# Altium schematic sheet mcu_base.SchDoc
size Letter
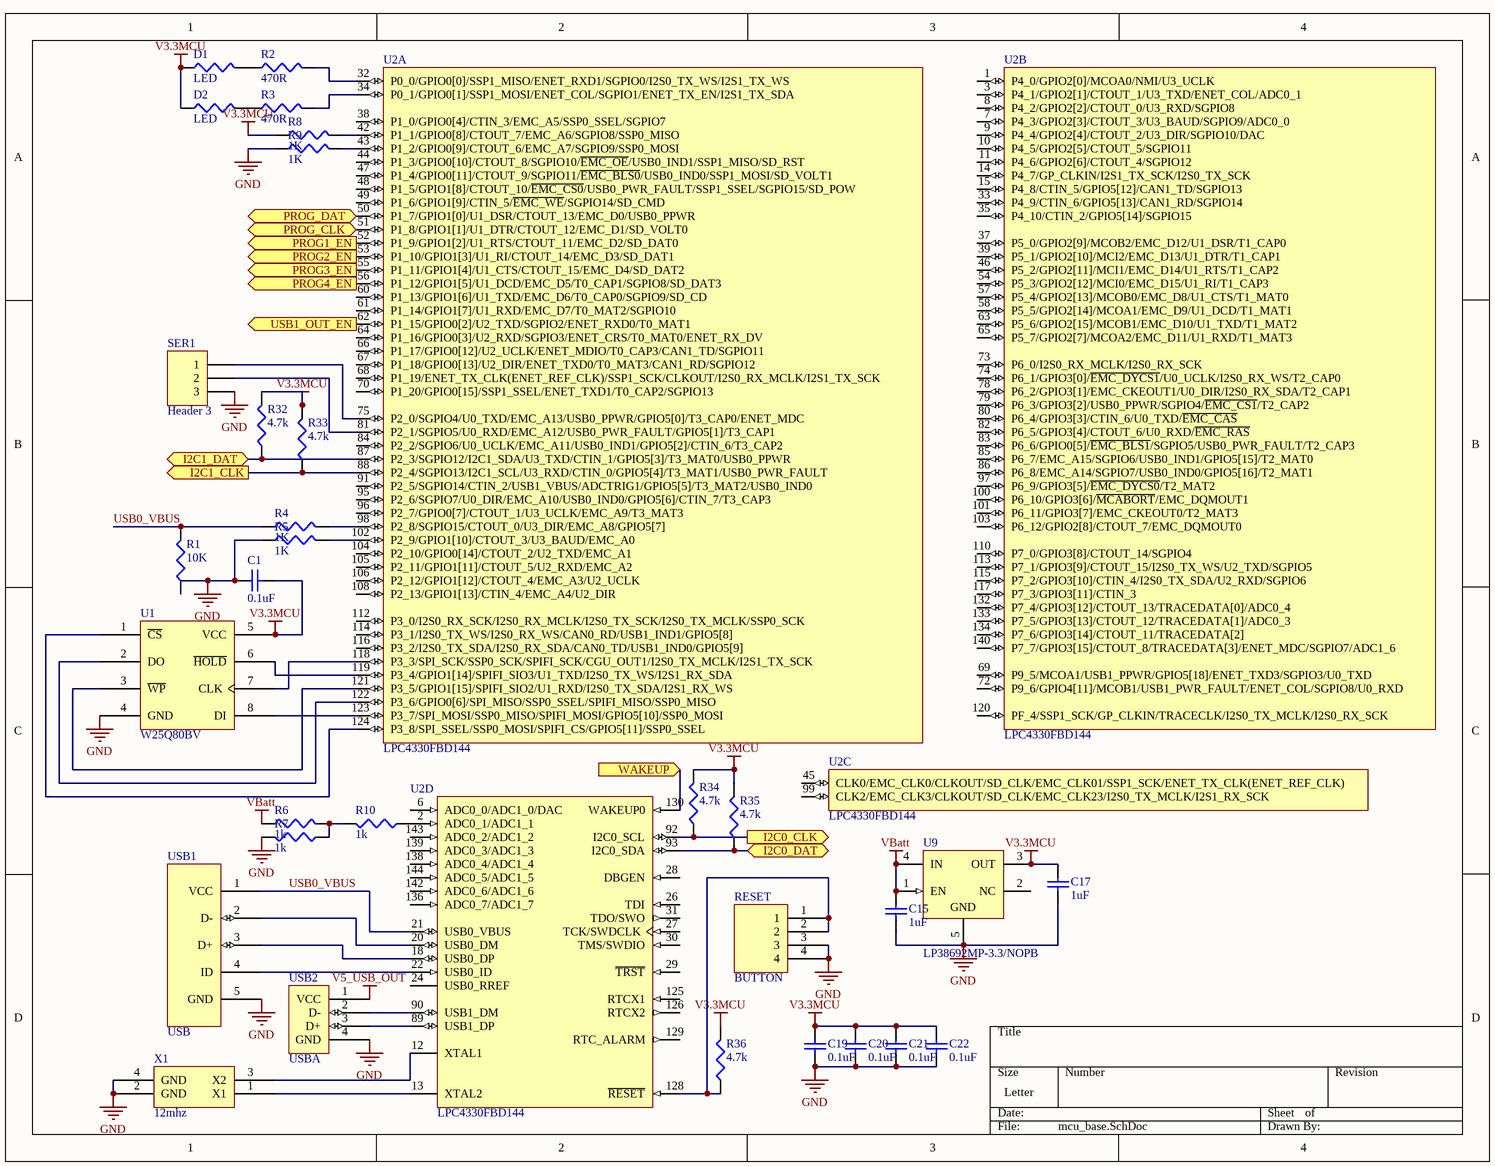
[diagram p0: mcu_base.SchDoc]

## Parts
C1  0.1uF  [1608[0603]]
C15  1uF  [1608[0603]]
C17  1uF  [1608[0603]]
C19  0.1uF  [1608[0603]]
C20  0.1uF  [1608[0603]]
C21  0.1uF  [1608[0603]]
C22  0.1uF  [1608[0603]]
D1  LED  [J1-0603]
D2  LED  [J1-0603]
R1  10K  [J1-0603]
R2  470R  [J1-0603]
R3  470R  [J1-0603]
R4  1K  [J1-0603]
R5  1K  [J1-0603]
R6  1k  [J1-0603]
R7  1k  [J1-0603]
R8  1K  [J1-0603]
R9  1K  [J1-0603]
R10  1k  [J1-0603]
R32  4.7k  [J1-0603]
R33  4.7k  [J1-0603]
R34  4.7k  [J1-0603]
R35  4.7k  [J1-0603]
R36  4.7k  [J1-0603]
RESET  BUTTON  [B3FS_SWITCH]
SER1  Header 3  [HDR1X3]
U1  W25Q80BV  [D8_N]
U2  LPC4330FBD144  [SOT486-1_V]  (parts A,B,C,D of 5)
U9  LP38692MP-3.3/NOPB  [MP05A_N]
USB1  USB  [USB/SM0.8-6H5]
USB2  USBA  [USB2.5-2V4A]
X1  12mhz  [2SMX-3SMXB]

## Ports
I2C0_CLK (out), I2C0_DAT (bidir), I2C1_CLK (out), I2C1_DAT (bidir), PROG1_EN (out), PROG2_EN (out), PROG3_EN (out), PROG4_EN (out), PROG_CLK (bidir), PROG_DAT (bidir), USB1_OUT_EN (out), WAKEUP (in)

## Nets
GND: C1.1 C15.1 C17.1 C19.1 C20.1 C21.1 C22.1 R1.1 R5.1 R7.2 R9.1 RESET.3 RESET.4 SER1.3 U1.4(GND) U9.5(GND) USB1.5(GND) USB2.4(GND) X1.2(GND) X1.4(GND)
V3.3MCU: C1.2 C17.2 C19.2 C20.2 C21.2 C22.2 D1.1 D2.1 R8.1 R32.2 R33.2 R34.2 R35.2 R36.2 U1.5(VCC) U9.3(OUT)
V5_USB_OUT: USB2.1(VCC)
VBatt: C15.2 R6.1 U9.1(EN) U9.4(IN)
I2C0_CLK: R34.1 U2.92(I2C0_SCL) ; port I2C0_CLK
I2C0_DAT: R35.1 U2.93(I2C0_SDA) ; port I2C0_DAT
I2C1_CLK: R33.1 U2.88(P2_4/SGPIO13/I2C1_SCL/U3_RXD/CTIN_0/GPIO5[4]/T3_MAT1/USB0_PWR_FAULT) ; port I2C1_CLK
I2C1_DAT: R32.1 U2.87(P2_3/SGPIO12/I2C1_SDA/U3_TXD/CTIN_1/GPIO5[3]/T3_MAT0/USB0_PPWR) ; port I2C1_DAT
PROG1_EN: U2.52(P1_9/GPIO1[2]/U1_RTS/CTOUT_11/EMC_D2/SD_DAT0) ; port PROG1_EN
PROG2_EN: U2.53(P1_10/GPIO1[3]/U1_RI/CTOUT_14/EMC_D3/SD_DAT1) ; port PROG2_EN
PROG3_EN: U2.55(P1_11/GPIO1[4]/U1_CTS/CTOUT_15/EMC_D4/SD_DAT2) ; port PROG3_EN
PROG4_EN: U2.56(P1_12/GPIO1[5]/U1_DCD/EMC_D5/T0_CAP1/SGPIO8/SD_DAT3) ; port PROG4_EN
PROG_CLK: U2.51(P1_8/GPIO1[1]/U1_DTR/CTOUT_12/EMC_D1/SD_VOLT0) ; port PROG_CLK
PROG_DAT: U2.50(P1_7/GPIO1[0]/U1_DSR/CTOUT_13/EMC_D0/USB0_PPWR) ; port PROG_DAT
USB0_VBUS: R1.2 R4.1 U2.21(USB0_VBUS) USB1.1(VCC)
USB1_OUT_EN: U2.62(P1_15/GPIO0[2]/U2_TXD/SGPIO2/ENET_RXD0/T0_MAT1) ; port USB1_OUT_EN
WAKEUP: U2.130(WAKEUP0) ; port WAKEUP
NetD1_2: D1.2 R2.1
NetD2_2: D2.2 R3.1
NetR2_2: R2.2 U2.32(P0_0/GPIO0[0]/SSP1_MISO/ENET_RXD1/SGPIO0/I2S0_TX_WS/I2S1_TX_WS)
NetR3_2: R3.2 U2.34(P0_1/GPIO0[1]/SSP1_MOSI/ENET_COL/SGPIO1/ENET_TX_EN/I2S1_TX_SDA)
NetR4_2: R4.2 U2.98(P2_8/SGPIO15/CTOUT_0/U3_DIR/EMC_A8/GPIO5[7])
NetR5_2: R5.2 U2.102(P2_9/GPIO1[10]/CTOUT_3/U3_BAUD/EMC_A0)
NetR6_2: R6.2 R7.1 R10.2
NetR8_2: R8.2 U2.42(P1_1/GPIO0[8]/CTOUT_7/EMC_A6/SGPIO8/SSP0_MISO)
NetR9_2: R9.2 U2.43(P1_2/GPIO0[9]/CTOUT_6/EMC_A7/SGPIO9/SSP0_MOSI)
NetR10_1: R10.1 U2.2(ADC0_1/ADC1_1)
NetR36_1: R36.1 RESET.1 RESET.2 U2.128(~{RESET})
NetSER1_1: SER1.1 U2.75(P2_0/SGPIO4/U0_TXD/EMC_A13/USB0_PPWR/GPIO5[0]/T3_CAP0/ENET_MDC)
NetSER1_2: SER1.2 U2.81(P2_1/SGPIO5/U0_RXD/EMC_A12/USB0_PWR_FAULT/GPIO5[1]/T3_CAP1)
NetU1_1: U1.1(~{CS}) U2.124(P3_8/SPI_SSEL/SSP0_MOSI/SPIFI_CS/GPIO5[11]/SSP0_SSEL)
NetU1_2: U1.2(DO) U2.122(P3_6/GPIO0[6]/SPI_MISO/SSP0_SSEL/SPIFI_MISO/SSP0_MISO)
NetU1_3: U1.3(~{WP}) U2.121(P3_5/GPIO1[15]/SPIFI_SIO2/U1_RXD/I2S0_TX_SDA/I2S1_RX_WS)
NetU1_6: U1.6(~{HOLD}) U2.119(P3_4/GPIO1[14]/SPIFI_SIO3/U1_TXD/I2S0_TX_WS/I2S1_RX_SDA)
NetU1_7: U1.7(CLK) U2.118(P3_3/SPI_SCK/SSP0_SCK/SPIFI_SCK/CGU_OUT1/I2S0_TX_MCLK/I2S1_TX_SCK)
NetU1_8: U1.8(DI) U2.123(P3_7/SPI_MOSI/SSP0_MISO/SPIFI_MOSI/GPIO5[10]/SSP0_MOSI)
NetU2_12: U2.12(XTAL1) X1.3(X2)
NetU2_13: U2.13(XTAL2) X1.1(X1)
NetU2_18: U2.18(USB0_DP) USB1.3(D+)
NetU2_20: U2.20(USB0_DM) USB1.2(D-)
NetU2_22: U2.22(USB0_ID) USB1.4(ID)
NetU2_89: U2.89(USB1_DP) USB2.3(D+)
NetU2_90: U2.90(USB1_DM) USB2.2(D-)

Not connected (* = marked no-connect by the designer): U2 1(P4_0/GPIO2[0]/MCOA0/NMI/U3_UCLK) 3(P4_1/GPIO2[1]/CTOUT_1/U3_TXD/ENET_COL/ADC0_1) 6(ADC0_0/ADC1_0/DAC) 7(P4_3/GPIO2[3]/CTOUT_3/U3_BAUD/SGPIO9/ADC0_0) 8(P4_2/GPIO2[2]/CTOUT_0/U3_RXD/SGPIO8) 9(P4_4/GPIO2[4]/CTOUT_2/U3_DIR/SGPIO10/DAC) 10(P4_5/GPIO2[5]/CTOUT_5/SGPIO11) 11(P4_6/GPIO2[6]/CTOUT_4/SGPIO12) 14(P4_7/GP_CLKIN/I2S1_TX_SCK/I2S0_TX_SCK) 15(P4_8/CTIN_5/GPIO5[12]/CAN1_TD/SGPIO13) 24(USB0_RREF) 26(TDI) 27(TCK/SWDCLK) 28(DBGEN) 29(~{TRST}) 30(TMS/SWDIO) 31(TDO/SWO) 33(P4_9/CTIN_6/GPIO5[13]/CAN1_RD/SGPIO14) 35(P4_10/CTIN_2/GPIO5[14]/SGPIO15) 37(P5_0/GPIO2[9]/MCOB2/EMC_D12/U1_DSR/T1_CAP0) 38(P1_0/GPIO0[4]/CTIN_3/EMC_A5/SSP0_SSEL/SGPIO7) 39(P5_1/GPIO2[10]/MCI2/EMC_D13/U1_DTR/T1_CAP1) 44(P1_3/GPIO0[10]/CTOUT_8/SGPIO10/~{EMC_OE}/USB0_IND1/SSP1_MISO/SD_RST) 45(CLK0/EMC_CLK0/CLKOUT/SD_CLK/EMC_CLK01/SSP1_SCK/ENET_TX_CLK(ENET_REF_CLK)) 46(P5_2/GPIO2[11]/MCI1/EMC_D14/U1_RTS/T1_CAP2) 47(P1_4/GPIO0[11]/CTOUT_9/SGPIO11/~{EMC_BLS0}/USB0_IND0/SSP1_MOSI/SD_VOLT1) 48(P1_5/GPIO1[8]/CTOUT_10/~{EMC_CS0}/USB0_PWR_FAULT/SSP1_SSEL/SGPIO15/SD_POW) 49(P1_6/GPIO1[9]/CTIN_5/~{EMC_WE}/SGPIO14/SD_CMD) 54(P5_3/GPIO2[12]/MCI0/EMC_D15/U1_RI/T1_CAP3) 57(P5_4/GPIO2[13]/MCOB0/EMC_D8/U1_CTS/T1_MAT0) 58(P5_5/GPIO2[14]/MCOA1/EMC_D9/U1_DCD/T1_MAT1) 60(P1_13/GPIO1[6]/U1_TXD/EMC_D6/T0_CAP0/SGPIO9/SD_CD) 61(P1_14/GPIO1[7]/U1_RXD/EMC_D7/T0_MAT2/SGPIO10) 63(P5_6/GPIO2[15]/MCOB1/EMC_D10/U1_TXD/T1_MAT2) 64(P1_16/GPIO0[3]/U2_RXD/SGPIO3/ENET_CRS/T0_MAT0/ENET_RX_DV) 65(P5_7/GPIO2[7]/MCOA2/EMC_D11/U1_RXD/T1_MAT3) 66(P1_17/GPIO0[12]/U2_UCLK/ENET_MDIO/T0_CAP3/CAN1_TD/SGPIO11) 67(P1_18/GPIO0[13]/U2_DIR/ENET_TXD0/T0_MAT3/CAN1_RD/SGPIO12) 68(P1_19/ENET_TX_CLK(ENET_REF_CLK)/SSP1_SCK/CLKOUT/I2S0_RX_MCLK/I2S1_TX_SCK) 69(P9_5/MCOA1/USB1_PPWR/GPIO5[18]/ENET_TXD3/SGPIO3/U0_TXD) 70(P1_20/GPIO0[15]/SSP1_SSEL/ENET_TXD1/T0_CAP2/SGPIO13) 72(P9_6/GPIO4[11]/MCOB1/USB1_PWR_FAULT/ENET_COL/SGPIO8/U0_RXD) 73(P6_0/I2S0_RX_MCLK/I2S0_RX_SCK) 74(P6_1/GPIO3[0]/~{EMC_DYCS1}/U0_UCLK/I2S0_RX_WS/T2_CAP0) 78(P6_2/GPIO3[1]/EMC_CKEOUT1/U0_DIR/I2S0_RX_SDA/T2_CAP1) 79(P6_3/GPIO3[2]/USB0_PPWR/SGPIO4/~{EMC_CS1}/T2_CAP2) 80(P6_4/GPIO3[3]/CTIN_6/U0_TXD/~{EMC_CAS}) 82(P6_5/GPIO3[4]/CTOUT_6/U0_RXD/~{EMC_RAS}) 83(P6_6/GPIO0[5]/~{EMC_BLS1}/SGPIO5/USB0_PWR_FAULT/T2_CAP3) 84(P2_2/SGPIO6/U0_UCLK/EMC_A11/USB0_IND1/GPIO5[2]/CTIN_6/T3_CAP2) 85(P6_7/EMC_A15/SGPIO6/USB0_IND1/GPIO5[15]/T2_MAT0) 86(P6_8/EMC_A14/SGPIO7/USB0_IND0/GPIO5[16]/T2_MAT1) 91(P2_5/SGPIO14/CTIN_2/USB1_VBUS/ADCTRIG1/GPIO5[5]/T3_MAT2/USB0_IND0) 95(P2_6/SGPIO7/U0_DIR/EMC_A10/USB0_IND0/GPIO5[6]/CTIN_7/T3_CAP3) 96(P2_7/GPIO0[7]/CTOUT_1/U3_UCLK/EMC_A9/T3_MAT3) 97(P6_9/GPIO3[5]/~{EMC_DYCS0}/T2_MAT2) 99(CLK2/EMC_CLK3/CLKOUT/SD_CLK/EMC_CLK23/I2S0_TX_MCLK/I2S1_RX_SCK) 100(P6_10/GPIO3[6]/~{MCABORT}/EMC_DQMOUT1) 101(P6_11/GPIO3[7]/EMC_CKEOUT0/T2_MAT3) 103(P6_12/GPIO2[8]/CTOUT_7/EMC_DQMOUT0) 104(P2_10/GPIO0[14]/CTOUT_2/U2_TXD/EMC_A1) 105(P2_11/GPIO1[11]/CTOUT_5/U2_RXD/EMC_A2) 106(P2_12/GPIO1[12]/CTOUT_4/EMC_A3/U2_UCLK) 108(P2_13/GPIO1[13]/CTIN_4/EMC_A4/U2_DIR) 110(P7_0/GPIO3[8]/CTOUT_14/SGPIO4) 112(P3_0/I2S0_RX_SCK/I2S0_RX_MCLK/I2S0_TX_SCK/I2S0_TX_MCLK/SSP0_SCK) 113(P7_1/GPIO3[9]/CTOUT_15/I2S0_TX_WS/U2_TXD/SGPIO5) 114(P3_1/I2S0_TX_WS/I2S0_RX_WS/CAN0_RD/USB1_IND1/GPIO5[8]) 115(P7_2/GPIO3[10]/CTIN_4/I2S0_TX_SDA/U2_RXD/SGPIO6) 116(P3_2/I2S0_TX_SDA/I2S0_RX_SDA/CAN0_TD/USB1_IND0/GPIO5[9]) 117(P7_3/GPIO3[11]/CTIN_3) 120(PF_4/SSP1_SCK/GP_CLKIN/TRACECLK/I2S0_TX_MCLK/I2S0_RX_SCK) 125(RTCX1) 126(RTCX2) 129(RTC_ALARM) 132(P7_4/GPIO3[12]/CTOUT_13/TRACEDATA[0]/ADC0_4) 133(P7_5/GPIO3[13]/CTOUT_12/TRACEDATA[1]/ADC0_3) 134(P7_6/GPIO3[14]/CTOUT_11/TRACEDATA[2]) 136(ADC0_7/ADC1_7) 138(ADC0_4/ADC1_4) 139(ADC0_3/ADC1_3) 140(P7_7/GPIO3[15]/CTOUT_8/TRACEDATA[3]/ENET_MDC/SGPIO7/ADC1_6) 142(ADC0_6/ADC1_6) 143(ADC0_2/ADC1_2) 144(ADC0_5/ADC1_5); U9 2(NC)

## Library data of the parts
C1 C15 C17 C19-C22 = Cap Semi: Capacitor (Semiconductor SIM Model); Value: 100pF; Published: 8-Jun-2000; LatestRevisionDate: 29-May-2009; LatestRevisionNote: IPC-7351 Footprint Added.; PackageReference: C1206; Publisher: Altium Limited; PackageDescription: Chip Capacitor
D1 D2 R1-R3 R32-R36 = Res3: Resistor; Value: 1K; Published: 8-Jun-2000; LatestRevisionDate: 29-May-2009; LatestRevisionNote: IPC-7351 Footprint Added.; PackageReference: J1-0603; Publisher: Altium Limited; PackageDescription: Chip Resistor
R4-R10 = Res3: Resistor; Published: 8-Jun-2000; LatestRevisionDate: 29-May-2009; LatestRevisionNote: IPC-7351 Footprint Added.; PackageReference: J1-0603; Publisher: Altium Limited; PackageDescription: Chip Resistor; Value: 1K
SER1 = Header 3: Header, 3-Pin; LatestRevisionDate: 17-Jul-2002; LatestRevisionNote: Re-released for DXP Platform.; Publisher: Altium Limited
U2 = LPC4330FBD144: 32-bit ARM Cortex-M4 MCU, 264 kB SRAM, 2 HS USB with on-chip PHY, Ethernet, CAN, AES, SPIFI, SGPIO, SCT, 144-Pin LQFP; fmax: 204 MHz; GPIOs: 83; SRAM: 264 kB; ROM: 64 kB; Ethernet: Y; USB: 2; ADC channels: 8; SPI: 1; UART: 4; VDD (min): 2.2 V; VDD (max): 3.6 V; Code_IEC: 136E23; DatasheetVersion: Rev.3.1, Jan-2012; PackageVersion: Feb-2003; PackageReference: SOT486-1; PackageDescription: LQFP144: Plastic Low Profile Quad Flat Package; 144 Leads; Body 20 x 20 x 1.4 mm; PWM: Y; PLL: Y; I2C: 2; CAN: 2; Timers: 4; Code_JEDEC: MS-026; ComponentLink1Description: Manufacturer URL; ComponentLink1URL: http://www.nxp.com/; ComponentLink2Description: Datasheet; ComponentLink2URL: http://www.nxp.com/documents/data_sheet/LPC4350_30_20_10.pdf
U9 = LP38692MP-3.3/NOPB: 1A Low Dropout CMOS Linear Regulators, Stable with Ceramic Output Capacitors, 5-pin SOT-223, Pb-Free; Manufacturer: National Semiconductor; PackageTopMarking: XYTT*LJSB; PowerWise: Y; CompType: LDO IC; DatasheetVersion: May-2005; PackageVersion: revA, Jan-2000; PackageReference: MP05A; PackageDescription: Moldec SOT-223, 6.50 x 3.56 x 1.6mm Body, 5 Lead, 1.5mm Pitch; PartNumber: LP38692MP-3.3/NOPB; RoHS: Y; PinCount: 5; High-Reliability: Y; Code_JEDEC: TO-261-AB; Code_IPC: SOT223-5; ComponentLink1Description: Manufacturer URL; ComponentLink1URL: http://www.national.com/; ComponentLink2Description: LP38692 Datasheet; ComponentLink2URL: http://www.national.com/ds/LP/LP38692.pdf; ComponentLink3Description: LP38692 Web Page; ComponentLink3URL: http://www.national.com/pf/LP/LP38692.html; ComponentLink4Description: MP05A Package Page; ComponentLink4URL: http://www.national.com/packaging/folders/mp05a.html
X1 = crystal